# EAGLE design LEDcontroller (EAGLE 9.6.2)
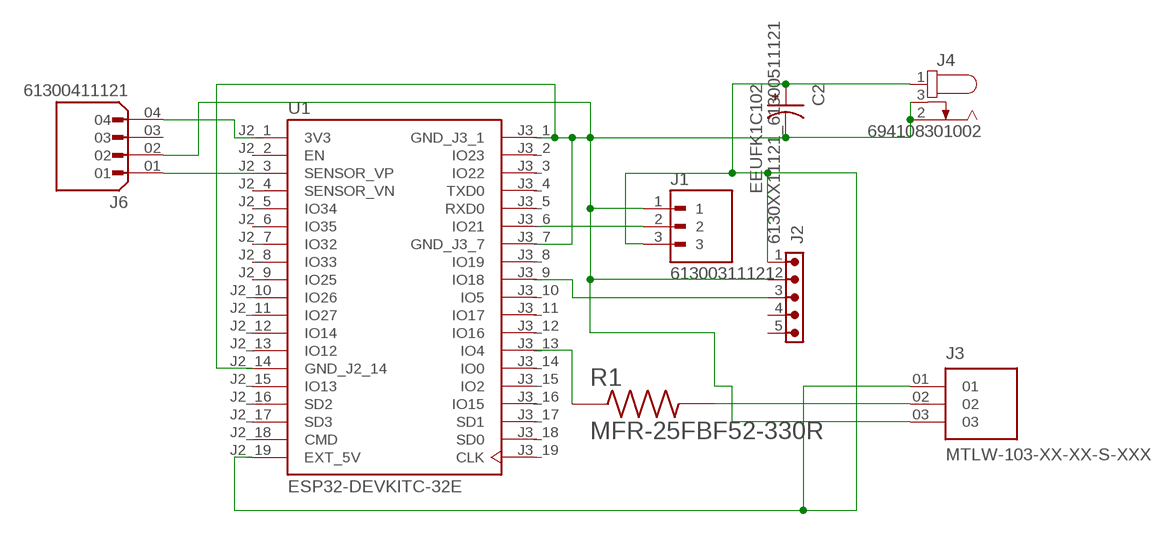
[diagram p0: schematic, sheet 1]

## Parts
C2  EEUFK1C102  [CAPPRD500W60D1000H1600]
J1  61300311121  [WURTH_61300311121]
J2  6130XX11121_61300511121  [61300511121]
J3  MTLW-103-XX-XX-S-XXX  [SAMTEC_MTLW-103-XX-XX-S-XXX]
J4  694108301002  [694108301002]
J6  61300411121  [WURTH_61300411121]
R1  MFR-25FBF52-330R  MFR-25FBF52-1K  [RESAD1100W55L680D260]
U1  ESP32-DEVKITC-32E  [MODULE_ESP32-DEVKITC-32E]

## Nets
GND [GND]: C2.N J1.1 J2.2 J3.03 J4.2 J4.3 J6.02 U1.J2_14(GND_J2_14) U1.J3_1(GND_J3_1) U1.J3_7(GND_J3_7)
N$1: J2.3 U1.J3_9(IO18)
N$2 [VCC]: J6.04 U1.J2_1(3V3)
N$3: J1.2 U1.J3_6(IO21)
N$4: J3.02 R1.2
N$5: J6.01 U1.J2_3(SENSOR_VP)
N$6: R1.1 U1.J3_13(IO4)
VCC [VCC]: C2.P J1.3 J2.1 J3.01 J4.1 U1.J2_19(EXT_5V)
Unconnected: J2.4 J2.5 J6.03 U1.J2_2(EN) U1.J2_4(SENSOR_VN) U1.J2_5(IO34) U1.J2_6(IO35) U1.J2_7(IO32) U1.J2_8(IO33) U1.J2_9(IO25) U1.J2_10(IO26) U1.J2_11(IO27) U1.J2_12(IO14) U1.J2_13(IO12) U1.J2_15(IO13) U1.J2_16(SD2) U1.J2_17(SD3) U1.J2_18(CMD) U1.J3_2(IO23) U1.J3_3(IO22) U1.J3_4(TXD0) U1.J3_5(RXD0) U1.J3_8(IO19) U1.J3_10(IO5) U1.J3_11(IO17) U1.J3_12(IO16) U1.J3_14(IO0) U1.J3_15(IO2) U1.J3_16(IO15) U1.J3_17(SD1) U1.J3_18(SD0) U1.J3_19(CLK)

## Library data of the parts
C2 = EEUFK1C102:EEUFK1C102: Check availability <https://pricing.snapeda.com/parts/EEU-FK1C102/Panasonic%20Electronic%20Components/view-part?ref=eda>; AVAILABILITY: In Stock; CHECK_PRICES: https://www.snapeda.com/parts/EEU-FK1C102/Panasonic+Electronic+Components/view-part/?ref=eda; DESCRIPTION: 1000uF 16V dc ALUM Electrolytic Capacitor,FK Radial Series 4000h 10(Dia.)x16mm | Panasonic Electronic Components EEU-FK1C102; MF: Panasonic Electronic Components; MP: EEU-FK1C102; PACKAGE: RADIAL-2 Panasonic; PRICE: None; SNAPEDA_LINK: https://www.snapeda.com/parts/EEU-FK1C102/Panasonic+Electronic+Components/view-part/?ref=snap
J1 = 61300311121:61300311121; CHECK_PRICES: https://www.snapeda.com/parts/61300311121/Wurth+Electronics/view-part/?ref=eda; DESCRIPTION: 3 pins, 1 row, straight, gold plating; DIGIKEY_PART_NUMBER: 732-5316-ND; MF: Wurth Electronics; MP: 61300311121; PACKAGE: None; SNAPEDA_LINK: https://www.snapeda.com/parts/61300311121/Wurth+Electronics/view-part/?ref=snap
J2 = 6130XX11121_61300511121:6130XX11121_61300511121; CHECK_PRICES: https://www.snapeda.com/parts/61300511121/Wurth+Electronics/view-part/?ref=eda; DESCRIPTION: 5 pins, 1 row, straight, gold plating; DIGIKEY_PART_NUMBER: 732-5318-ND; MF: Wurth Electronics; MP: 61300511121; PACKAGE: None; SNAPEDA_LINK: https://www.snapeda.com/parts/61300511121/Wurth+Electronics/view-part/?ref=snap
J3 = MTLW-103-XX-XX-S-XXX:MTLW-103-XX-XX-S-XXX; CHECK_PRICES: https://www.snapeda.com/parts/MTLW-103-07-G-S-230/Samtec/view-part/?ref=eda; DESCRIPTION: Connector Header Through Hole 3 position 0.100 (2.54mm); DIGIKEY_PART_NUMBER: SAM11546-ND; MF: Samtec; MP: MTLW-103-07-G-S-230; PACKAGE: None; SNAPEDA_LINK: https://www.snapeda.com/parts/MTLW-103-07-G-S-230/Samtec/view-part/?ref=snap
J4 = 694108301002:694108301002; CHECK_PRICES: https://www.snapeda.com/parts/694108301002/W%25C3%25BCrth+Elektronik+Midcom/view-part/?ref=eda; DESCRIPTION: WR-DC Series, 5.5mm Right Angle Through Hole DC Power Socket 5A | Wurth Electronics 694108301002; DIGIKEY_PART_NUMBER: 732-5934-ND; MF: Würth Elektronik; MP: 694108301002; PACKAGE: None; SNAPEDA_LINK: https://www.snapeda.com/parts/694108301002/W%25C3%25BCrth+Elektronik+Midcom/view-part/?ref=snap
J6 = 61300411121:61300411121; CHECK_PRICES: https://www.snapeda.com/parts/61300411121/Wurth+Electronics/view-part/?ref=eda; DESCRIPTION: 4 pins, 1 row, straight, gold plating; DIGIKEY_PART_NUMBER: 732-5317-ND; MF: Wurth Electronics; MP: 61300411121; PACKAGE: None; SNAPEDA_LINK: https://www.snapeda.com/parts/61300411121/Wurth+Electronics/view-part/?ref=snap
R1 = MFR-25FBF52-1K:MFR-25FBF52-1K: Check availability <https://pricing.snapeda.com/parts/MFR-25FBF52-1K/Yageo/view-part?ref=eda>; AVAILABILITY: In Stock; CHECK_PRICES: https://www.snapeda.com/parts/MFR-25FBF52-1K/Yageo/view-part/?ref=eda; DESCRIPTION: 1 kOhms ±1% 0.25W, 1/4W Through Hole Resistor Axial - Metal Film; MF: Yageo; MP: MFR-25FBF52-330R; PACKAGE: RADIAL-2 Yageo; PRICE: None; SNAPEDA_LINK: https://www.snapeda.com/parts/MFR-25FBF52-330R/Yageo/view-part/?ref=eda
U1 = ESP32-DEVKITC-32E:ESP32-DEVKITC-32E: Check availability <https://pricing.snapeda.com/parts/ESP32-DEVKITC-32E/Espressif%20Systems/view-part?ref=eda>; AVAILABILITY: In Stock; CHECK_PRICES: https://www.snapeda.com/parts/ESP32-DEVKITC-32E/Espressif+Systems/view-part/?ref=eda; DESCRIPTION: The ESP32-DEVKITC-32E transceiver evaluation board from Espressif Systems is a powerful development tool for wireless communication technologies. It supports 802.11 b/g/n Wi-Fi and Bluetooth® Smart Ready 4.x (BLE) dual-mode at 2.4GHz, making it ideal for a variety of IoT applications. Equipped with a PCB antenna and 4MB flash, this board provides reliable connectivity and ample memory for developing and testing RF, RFID, and wireless solutions.; MF: Espressif Systems; MP: ESP32-DEVKITC-32E; PACKAGE: None; PRICE: None; PURCHASE-URL: https://www.snapeda.com/api/url_track_click_mouser/?unipart_id=4719025&manufacturer=Espressif Systems&part_name=ESP32-DEVKITC-32E&search_term=None; SNAPEDA_LINK: https://www.snapeda.com/parts/ESP32-DEVKITC-32E/Espressif+Systems/view-part/?ref=snap

## Net classes
0 default: width 0.3 mm, drill 0.3 mm, clearance 0.5 mm
1 VCC: width 2.2 mm, drill 0.3 mm, clearance 0.5 mm
2 GND: width 2.2 mm, drill 0.3 mm, clearance 0.5 mm

## Board
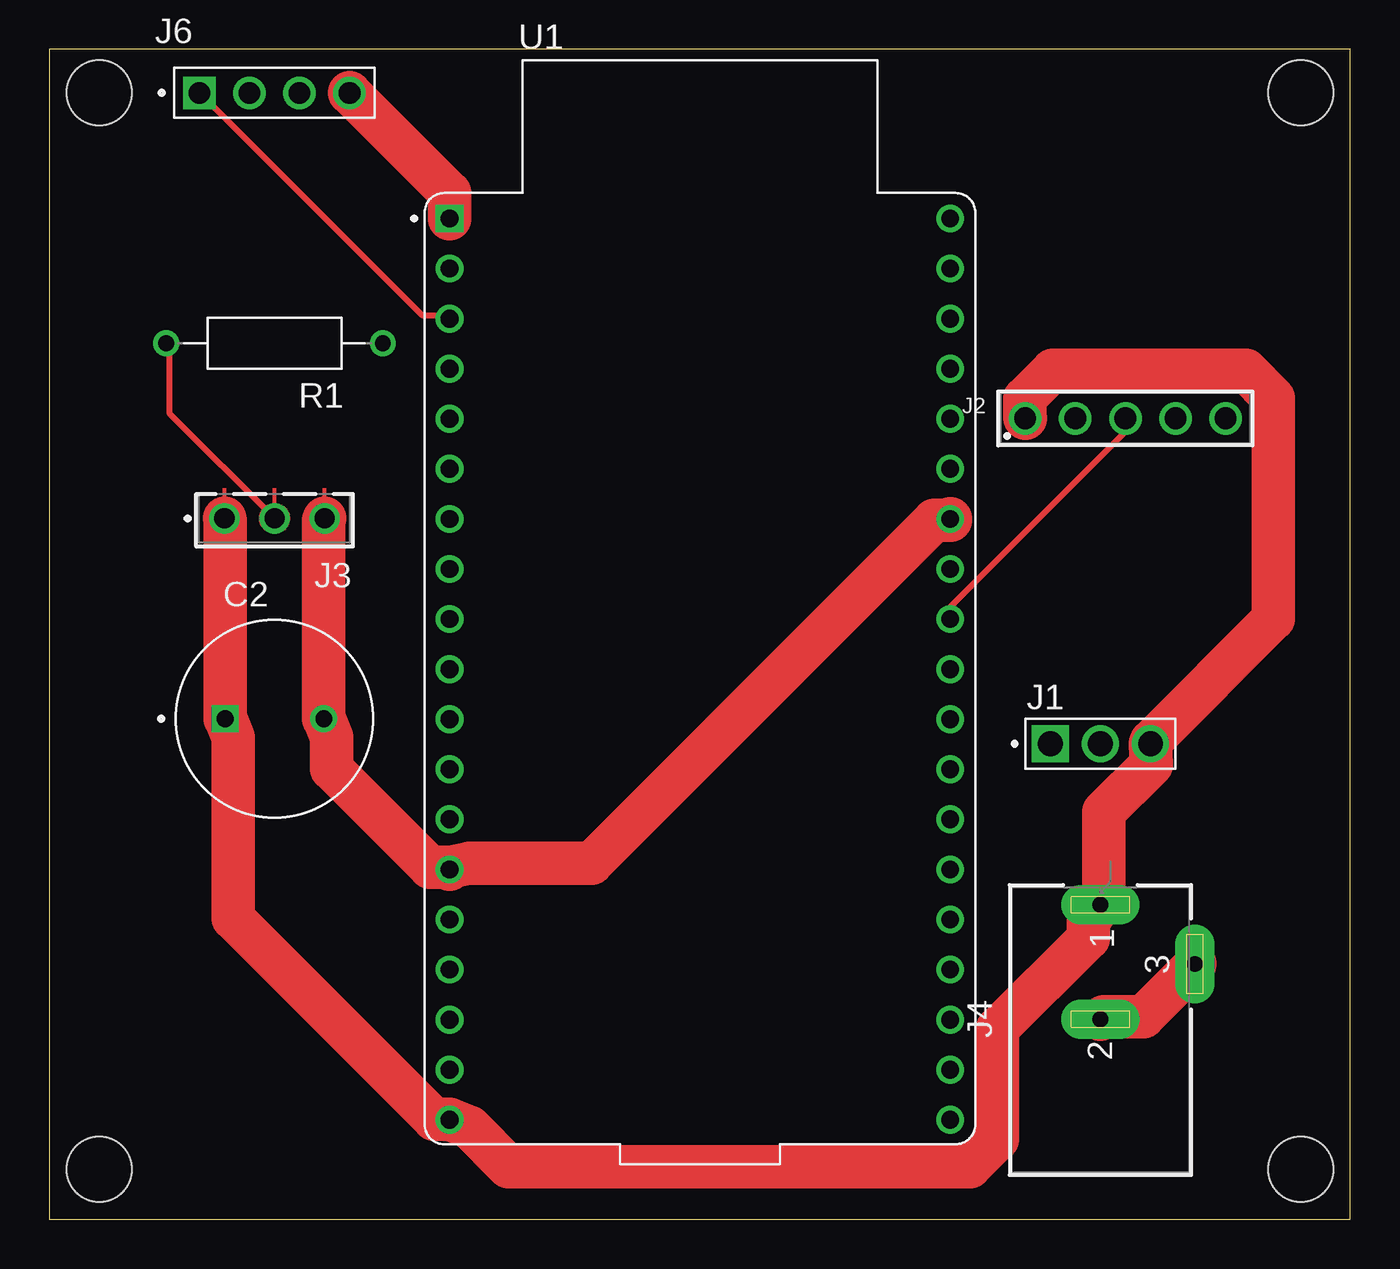
[diagram p1: board, top side]
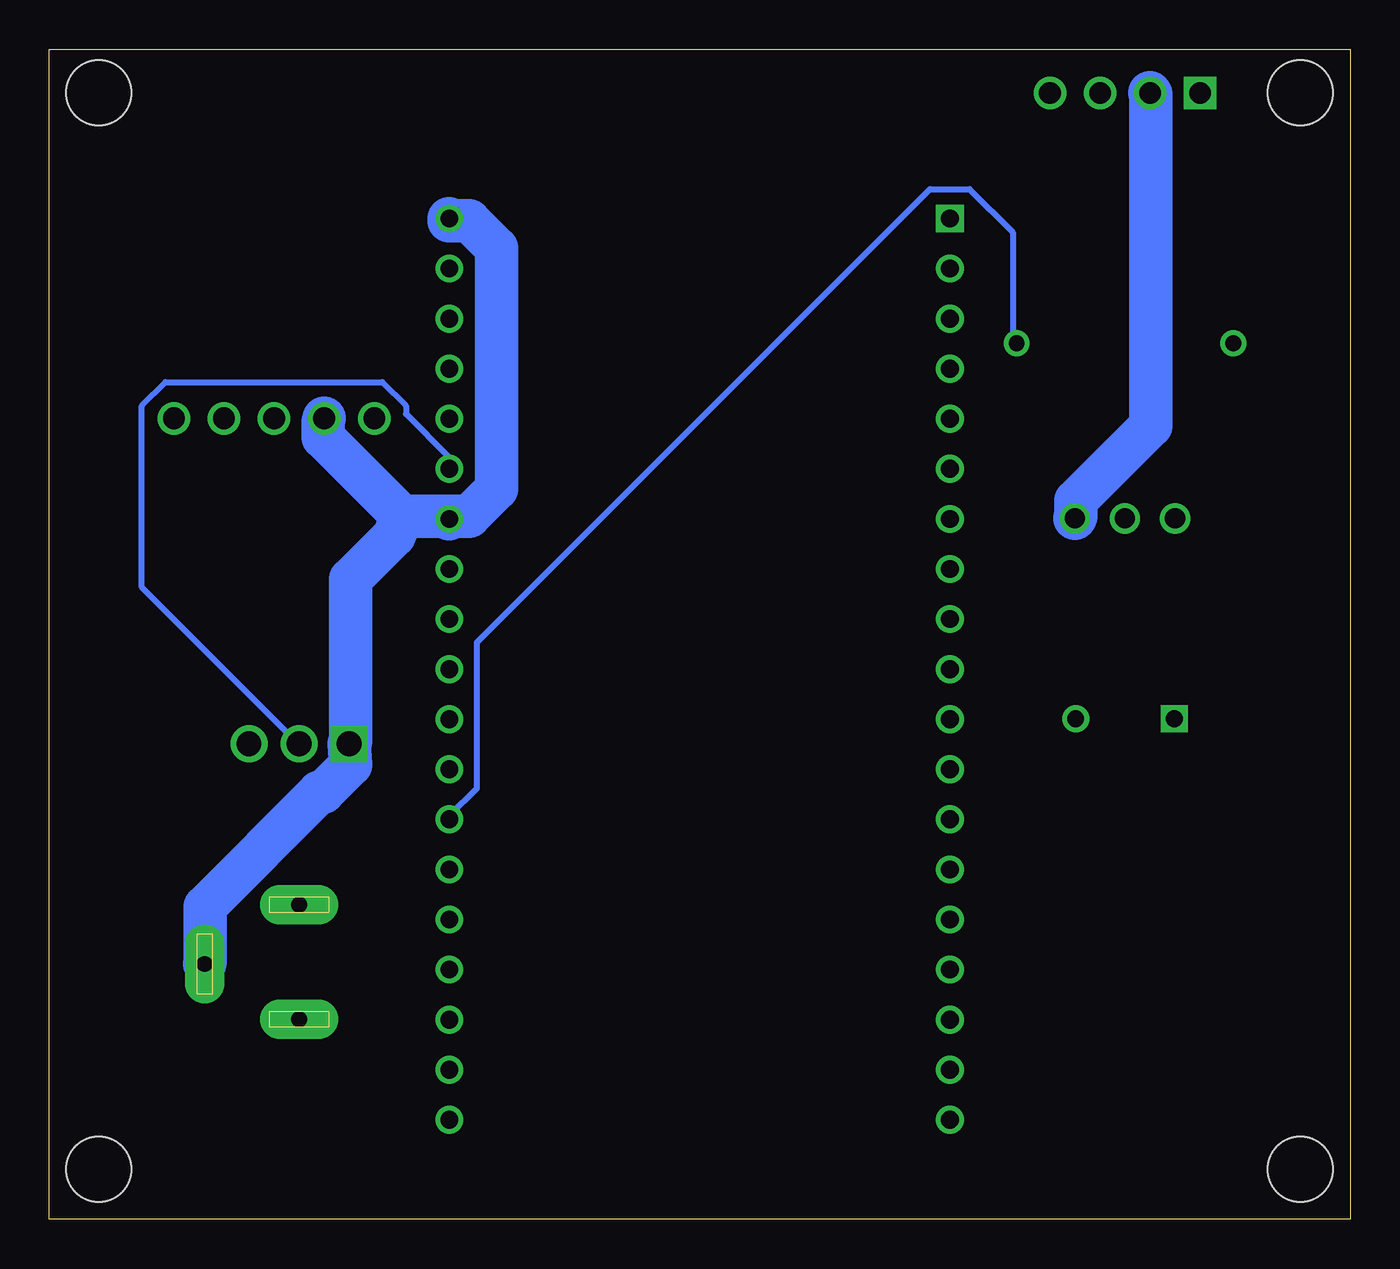
[diagram p2: board, bottom side, seen from below]

Size 66.02 x 59.36 mm. Coordinates in mm from the lower left corner, seen from the top.
Outline: 0,0 66.02,0 66.02,59.36 0,59.36 0,0
Copper layers (1*16): Top 0.035mm / dielectric 1.5mm / Bottom 0.035mm
Design rules "default": minimum track width 6mil, minimum drill 0.35mm, track to track 6mil, track to pad 6mil, pad to pad 6mil, via to via 6mil, smd to smd 6mil, copper to edge 40mil, drill to drill 6mil, minimum pad ring 10mil, minimum via ring 8mil, stop-mask expansion 4mil, vias tented up to drill 0mil, thermal gap 10mil
Holes 3.3 mm at 2.54,57.15 2.54,2.54 63.5,2.54 63.5,57.15

### Footprints (pad centres in the part's own frame; a part is rotated, then mirrored left to right if it is on the bottom)
CAPPRD500W60D1000H1600 = drill 0.85 pad 1.2: N 2.5,0 | drill 0.85 pad 1.2 square: P -2.5,0
WURTH_61300311121 = drill 1.25 square: 1 -2.54,0 | drill 1.25: 2 0,0; 3 2.54,0
61300511121 = drill 1.1: 1 -5.08,0; 2 -2.54,0; 3 0,0; 4 2.54,0; 5 5.08,0
SAMTEC_MTLW-103-XX-XX-S-XXX = drill 1.02 pad 1.52: 01 2.54,0; 02 0,0; 03 -2.54,0
694108301002 = drill 0.8 pad 2 long: 1 5.8,0; 2 0,0; 3 2.8,-4.8
WURTH_61300411121 = drill 1.1 pad 1.45 square: 01 -3.81,0 | drill 1.1 pad 1.45: 02 -1.27,0; 03 1.27,0; 04 3.81,0
RESAD1100W55L680D260 = drill 0.8 pad 1.2: 1 -5.5,0; 2 5.5,0
MODULE_ESP32-DEVKITC-32E = drill 0.9 square: J2_1 -12.7,22.835 | drill 0.9: J2_2 -12.7,20.295; J2_3 -12.7,17.755; J2_4 -12.7,15.215; J2_5 -12.7,12.675; J2_6 -12.7,10.135; J2_7 -12.7,7.595; J2_8 -12.7,5.055; J2_9 -12.7,2.515; J2_10 -12.7,-0.025; J2_11 -12.7,-2.565; J2_12 -12.7,-5.105; J2_13 -12.7,-7.645; J2_14 -12.7,-10.185; J2_15 -12.7,-12.725; J2_16 -12.7,-15.265; J2_17 -12.7,-17.805; J2_18 -12.7,-20.345; J2_19 -12.7,-22.885; J3_1 12.7,22.835; J3_2 12.7,20.295; J3_3 12.7,17.755; J3_4 12.7,15.215; J3_5 12.7,12.675; J3_6 12.7,10.135; J3_7 12.7,7.595; J3_8 12.7,5.055; J3_9 12.7,2.515; J3_10 12.7,-0.025; J3_11 12.7,-2.565; J3_12 12.7,-5.105; J3_13 12.7,-7.645; J3_14 12.7,-10.185; J3_15 12.7,-12.725; J3_16 12.7,-15.265; J3_17 12.7,-17.805; J3_18 12.7,-20.345; J3_19 12.7,-22.885

### Placement (x,y rotation side)
C2  11.43,25.4 0 top
J1  53.34,24.13 0 top
J2  54.61,40.64 0 top
J3  11.43,35.56 180 top
J4  53.34,10.16 90 top
J6  11.43,57.15 0 top
R1  11.43,44.45 180 top
U1  33.02,27.94 0 top

### Tracks (layer width: path | path; a pad name or v marks a point on that pad's centre or on a via)
GND
  Top 2.2: 13.92,25.47 13.92,35.47 J3.03 | 13.92,25.47 C2.N | 20.32,17.87 19.32,17.87 14.32,22.87 14.32,24.47 13.92,25.47 | 20.32,17.87 U1.J2_14 | J4.2 53.52,10.27 55.52,10.27 58.12,12.87 J4.3 | 20.32,17.87 21.32,18.07 27.52,18.07 44.92,35.47 45.72,35.47 U1.J3_7
  Bottom 2.2: J6.02 10.12,57.07 10.12,40.27 13.92,36.47 13.92,35.67 J3.03 | 48.12,35.67 45.72,35.67 | 48.12,35.67 52.12,39.67 52.12,40.47 J2.2 | 45.72,35.67 U1.J3_7 | U1.J3_1 45.72,50.67 44.72,50.67 43.32,49.27 43.32,37.07 44.72,35.67 45.72,35.67 | 48.12,35.67 48.52,34.67 50.72,32.47 50.72,24.27 J1.1 50.72,23.07 52.12,21.67 52.32,21.67 58.12,15.87 58.12,13.07 J4.3
N$1
  Top 0.3: U1.J3_9 45.72,31.07 54.52,39.87 54.52,40.47 J2.3
N$2
  Top 2.2: U1.J2_1 20.32,52.07 J6.04
N$3
  Bottom 0.3: U1.J3_6 45.72,38.67 47.92,40.87 47.92,41.27 49.12,42.47 60.12,42.47 61.32,41.27 61.32,32.07 53.52,24.27 J1.2
N$4
  Top 0.3: J3.02 6.12,40.87 6.12,44.27 R1.2
N$5
  Top 0.3: U1.J2_3 20.32,45.87 18.92,45.87 7.72,57.07 J6.01
N$6
  Bottom 0.3: R1.1 17.12,44.47 17.12,50.07 19.32,52.27 21.32,52.27 44.32,29.27 44.32,21.87 45.72,20.47 U1.J3_13
VCC
  Top 2.2: J2.1 49.52,40.67 49.52,41.67 50.92,43.07 60.72,43.07 62.12,41.67 62.12,30.47 55.92,24.27 J1.3 55.92,23.07 53.52,20.67 53.52,16.07 J4.1 52.72,15.07 52.72,14.27 48.12,9.67 48.12,4.07 46.72,2.67 23.32,2.67 21.32,4.67 U1.J2_19 | 8.92,25.47 8.92,35.47 J3.01 | 8.92,25.47 C2.P | U1.J2_19 19.52,5.07 9.32,15.27 9.32,24.47 8.92,25.47 | U1.J2_19